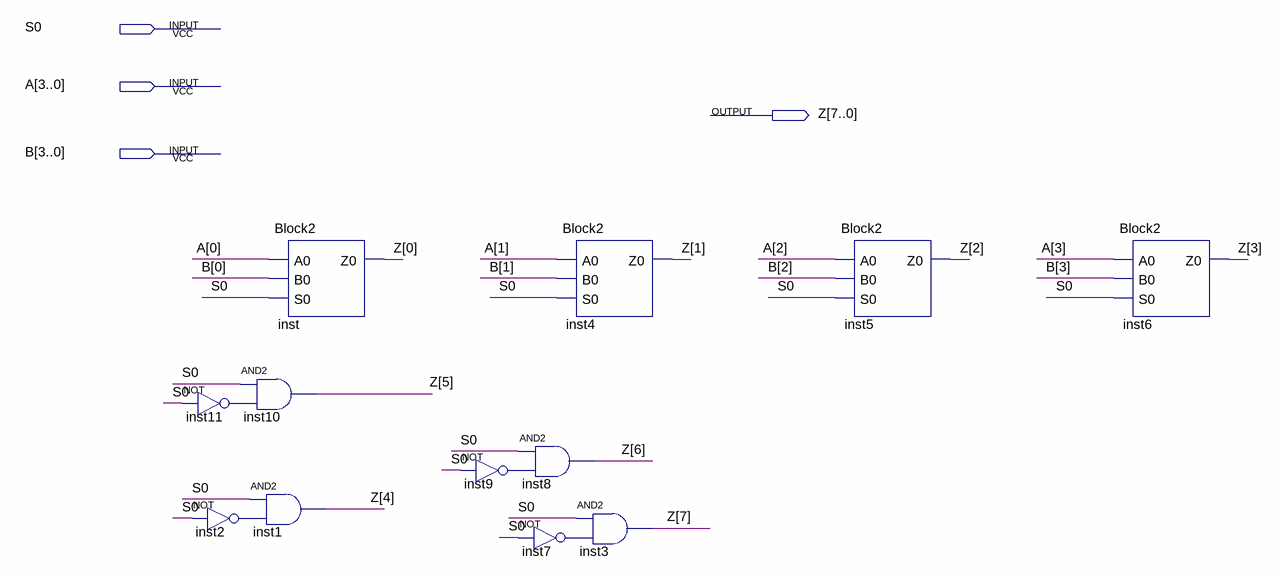
[diagram p0: schematic sheet]
// Quartus schematic MUX4b8b.bdf as structural Verilog: 12 symbols, 4 pins
module MUX4b8b (
  input  S0,
  input  [3:0] A,
  input  [3:0] B,
  output [7:0] Z
);

  wire inst2_out, inst7_out, inst9_out, inst11_out;

  and inst10 (Z[5], S0, inst11_out);
  not inst11 (inst11_out, S0);
  and inst1 (Z[4], S0, inst2_out);
  not inst2 (inst2_out, S0);
  Block2 inst (.A0(A[0]), .B0(B[0]), .S0(S0), .Z0(Z[0]));
  not inst9 (inst9_out, S0);
  Block2 inst4 (.A0(A[1]), .B0(B[1]), .S0(S0), .Z0(Z[1]));
  and inst8 (Z[6], S0, inst9_out);
  not inst7 (inst7_out, S0);
  and inst3 (Z[7], S0, inst7_out);
  Block2 inst5 (.A0(A[2]), .B0(B[2]), .S0(S0), .Z0(Z[2]));
  Block2 inst6 (.A0(A[3]), .B0(B[3]), .S0(S0), .Z0(Z[3]));
endmodule
